# Altium schematic sheet PC_ParallelPort.SchDoc: PC Parallel-Port Interface
size A4; Organization: Altium Limited.; Address1: Level 3, 12a Rodborough Rd; Address2: Frenchs Forest 2086; Address3: NSW; Address4: AUSTRALIA; Revision: 6; SheetNumber: 23; SheetTotal: 64
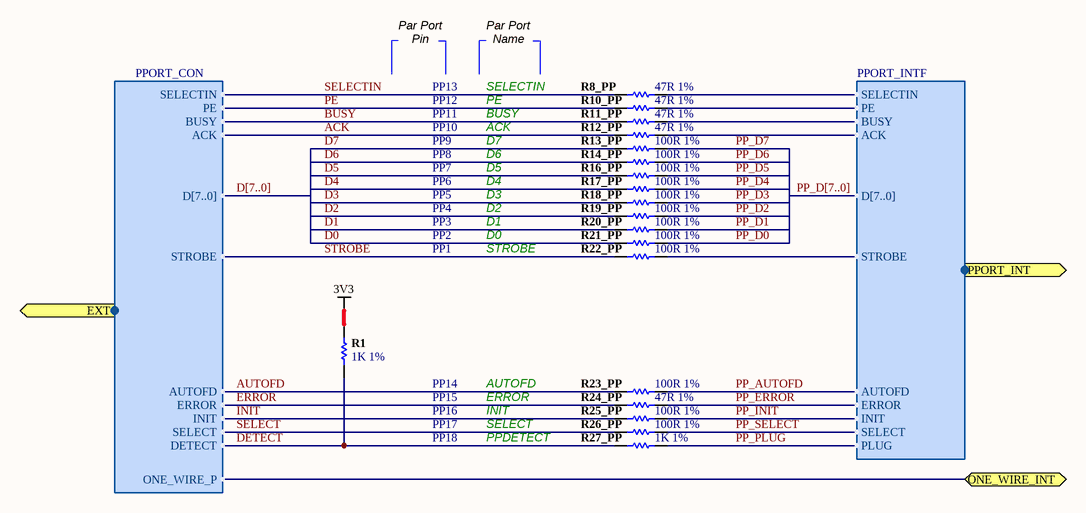
[diagram p0: PC_ParallelPort.SchDoc]

## Parts
R1  1K 1%  [RESC1005-STAR]
R8_PP  47R 1%  [RESC1005-STAR]
R10_PP  47R 1%  [RESC1005-STAR]
R11_PP  47R 1%  [RESC1005-STAR]
R12_PP  47R 1%  [RESC1005-STAR]
R13_PP  100R 1%  [RESC1005-STAR]
R14_PP  100R 1%  [RESC1005-STAR]
R16_PP  100R 1%  [RESC1005-STAR]
R17_PP  100R 1%  [RESC1005-STAR]
R18_PP  100R 1%  [RESC1005-STAR]
R19_PP  100R 1%  [RESC1005-STAR]
R20_PP  100R 1%  [RESC1005-STAR]
R21_PP  100R 1%  [RESC1005-STAR]
R22_PP  100R 1%  [RESC1005-STAR]
R23_PP  100R 1%  [RESC1005-STAR]
R24_PP  47R 1%  [RESC1005-STAR]
R25_PP  100R 1%  [RESC1005-STAR]
R26_PP  100R 1%  [RESC1005-STAR]
R27_PP  1K 1%  [RESC1005-STAR]

## Ports
EXT (harness PPORT_CON), ONE_WIRE_INT (bidir), PPORT_INT (harness PPORT_INTF)

## Harnesses
PPORT_INTF: SELECTIN, PE, BUSY, ACK, STROBE, AUTOFD, ERROR, INIT, SELECT, PLUG, D[7..0]
PPORT_CON: SELECTIN, PE, BUSY, ACK, STROBE, AUTOFD, ERROR, INIT, SELECT, DETECT, ONE_WIRE_P, D[7..0]

## Nets
3V3: R1.2
ACK: R12_PP.1 ; port EXT.ACK
AUTOFD: R23_PP.2 ; port EXT.AUTOFD
BUSY: R11_PP.1 ; port EXT.BUSY
D0: R21_PP.2
D1: R20_PP.2
D2: R19_PP.2
D3: R18_PP.2
D4: R17_PP.2
D5: R16_PP.2
D6: R14_PP.2
D7: R13_PP.2
DETECT: R1.1 R27_PP.2 ; port EXT.DETECT
ERROR: R24_PP.1 ; port EXT.ERROR
INIT: R25_PP.2 ; port EXT.INIT
ONE_WIRE_INT: port ONE_WIRE_INT, port EXT.ONE_WIRE_P
PE: R10_PP.1 ; port EXT.PE
PP_AUTOFD: R23_PP.1 ; port PPORT_INT.AUTOFD
PP_D0: R21_PP.1
PP_D1: R20_PP.1
PP_D2: R19_PP.1
PP_D3: R18_PP.1
PP_D4: R17_PP.1
PP_D5: R16_PP.1
PP_D6: R14_PP.1
PP_D7: R13_PP.1
PP_ERROR: R24_PP.2 ; port PPORT_INT.ERROR
PP_INIT: R25_PP.1 ; port PPORT_INT.INIT
PP_PLUG: R27_PP.1 ; port PPORT_INT.PLUG
PP_SELECT: R26_PP.1 ; port PPORT_INT.SELECT
SELECT: R26_PP.2 ; port EXT.SELECT
SELECTIN: R8_PP.1 ; port EXT.SELECTIN
STROBE: R22_PP.2 ; port EXT.STROBE
NetR8_PP_2: R8_PP.2 ; port PPORT_INT.SELECTIN
NetR10_PP_2: R10_PP.2 ; port PPORT_INT.PE
NetR11_PP_2: R11_PP.2 ; port PPORT_INT.BUSY
NetR12_PP_2: R12_PP.2 ; port PPORT_INT.ACK
NetR22_PP_1: R22_PP.1 ; port PPORT_INT.STROBE

## Buses and harness runs
bus D[7..0]
bus PP_D[7..0]

## Notes on the sheet
- Par Port
- Pin
- Name
- PP13
- PP12
- PP11
- PP10
- PP9
- SELECTIN
- PE
- BUSY
- ACK
- D7
- PP4
- PP6
- PP5
- PP7
- PP8
- D2
- D3
- D4
- D5
- D6
- PP1
- PP2
- PP3
- STROBE
- D0
- D1
- PP14
- PP15
- PP16
- AUTOFD
- ERROR
- INIT
- PP17
- PP18
- SELECT
- PPDETECT
- Sheet Title
- Project Title
- Size:
- Date:
- A4
- Number:
- Time:
- Sheet
- Revision:
- of
- File:

## Library data of the parts
R1 R27_PP = D-100-0121: Resistor, 1K 1% 0402 (1005); Power Rating: 63 mW; Category: Resistor; Mounting Technology: Surface Mount; Resistance: 1 K; Status: Production; Tolerance: 1 %
R8_PP R10_PP R11_PP R12_PP R24_PP = D-100-0090: Resistor, 47R 1% 0402 (1005); Power Rating: 63 mW; Category: Resistor; Mounting Technology: Surface Mount; Resistance: 47 R; Status: Production; Tolerance: 1 %
R13_PP R14_PP R16_PP R17_PP R18_PP R19_PP R20_PP R21_PP R22_PP R23_PP R25_PP R26_PP = D-100-0131: Resistor, 100R 1% 0402 (1005); Power Rating: 63 mW; Category: Resistor; Mounting Technology: Surface Mount; Resistance: 100 R; Status: Production; Tolerance: 1 %